# Altium schematic sheet ULN2003_SOP16N.SchDoc
size A3; SheetNumber: 3; SheetTotal: 10
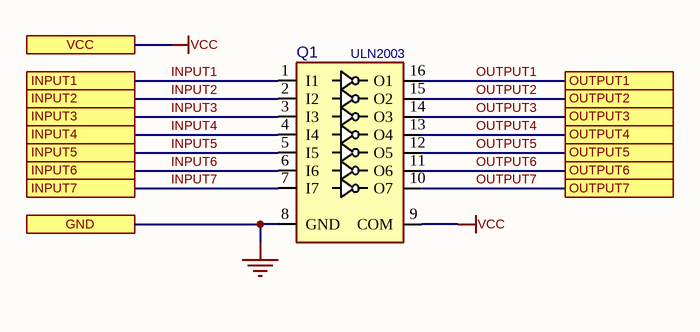
[diagram p0: ULN2003_SOP16N.SchDoc]

## Parts
Q1  ULN2003  [SO_16]

## Ports
GND, INPUT1, INPUT2, INPUT3, INPUT4, INPUT5, INPUT6, INPUT7, OUTPUT1, OUTPUT2, OUTPUT3, OUTPUT4, OUTPUT5, OUTPUT6, OUTPUT7, VCC

## Nets
GND: Q1.8(GND) ; port GND
VCC: Q1.9(COM) ; port VCC
INPUT1: Q1.1(I1) ; port INPUT1
INPUT2: Q1.2(I2) ; port INPUT2
INPUT3: Q1.3(I3) ; port INPUT3
INPUT4: Q1.4(I4) ; port INPUT4
INPUT5: Q1.5(I5) ; port INPUT5
INPUT6: Q1.6(I6) ; port INPUT6
INPUT7: Q1.7(I7) ; port INPUT7
OUTPUT1: Q1.16(O1) ; port OUTPUT1
OUTPUT2: Q1.15(O2) ; port OUTPUT2
OUTPUT3: Q1.14(O3) ; port OUTPUT3
OUTPUT4: Q1.13(O4) ; port OUTPUT4
OUTPUT5: Q1.12(O5) ; port OUTPUT5
OUTPUT6: Q1.11(O6) ; port OUTPUT6
OUTPUT7: Q1.10(O7) ; port OUTPUT7

## Library data of the parts
Q1 = ULN2003_SOP16_ST: Darlington, 7-CH, 50V, 0.5A, 5V TTL/CMOS; MANF_P#: ULN2003D1; MANF: ST; PARAM: 7-CH, 50V, 0.5A; PARAM2: 5V TTL/CMOS; VALUE: ULN2003